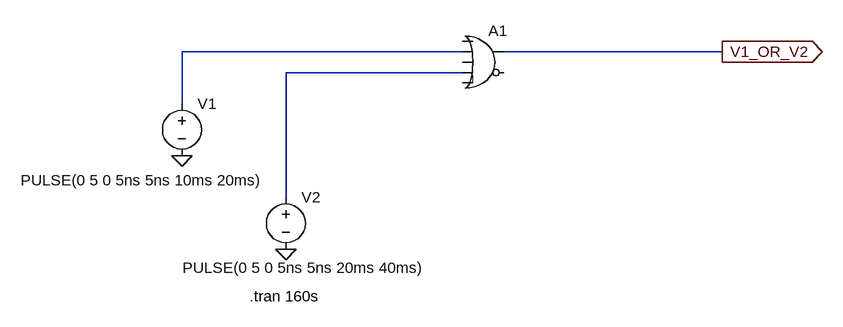
[diagram p0: schematic OR gate.asc]
OR gate.asc, the LTspice schematic file:
Version 4
SHEET 1 1112 680
WIRE 528 16 96 16
WIRE 928 16 592 16
WIRE 528 48 256 48
WIRE 96 96 96 16
WIRE 256 240 256 48
FLAG 256 320 0
FLAG 96 176 0
FLAG 928 16 V1_OR_V2
IOPIN 928 16 Out
SYMBOL voltage 96 80 R0
WINDOW 3 -248 134 Left 2
WINDOW 123 0 0 Left 0
WINDOW 39 0 0 Left 0
SYMATTR InstName V1
SYMATTR Value PULSE(0 5 0 5ns 5ns 10ms 20ms)
SYMBOL voltage 256 224 R0
WINDOW 3 -159 124 Left 2
WINDOW 123 0 0 Left 0
WINDOW 39 0 0 Left 0
SYMATTR InstName V2
SYMATTR Value PULSE(0 5 0 5ns 5ns 20ms 40ms)
SYMBOL Digital\\or 560 -32 R0
SYMATTR InstName A1
TEXT 200 392 Left 2 !.tran 160s

The netlist it stands for:
* OR gate.asc
V1 N001 0 PULSE(0 5 0 5ns 5ns 10ms 20ms)
V2 N002 0 PULSE(0 5 0 5ns 5ns 20ms 40ms)
A1 0 N001 0 N002 0 0 V1_OR_V2 0 OR
.tran 160s
.backanno
.end